# EAGLE design Kicking Device v13b (EAGLE 9.4.2)

## Sheet 1 of 2
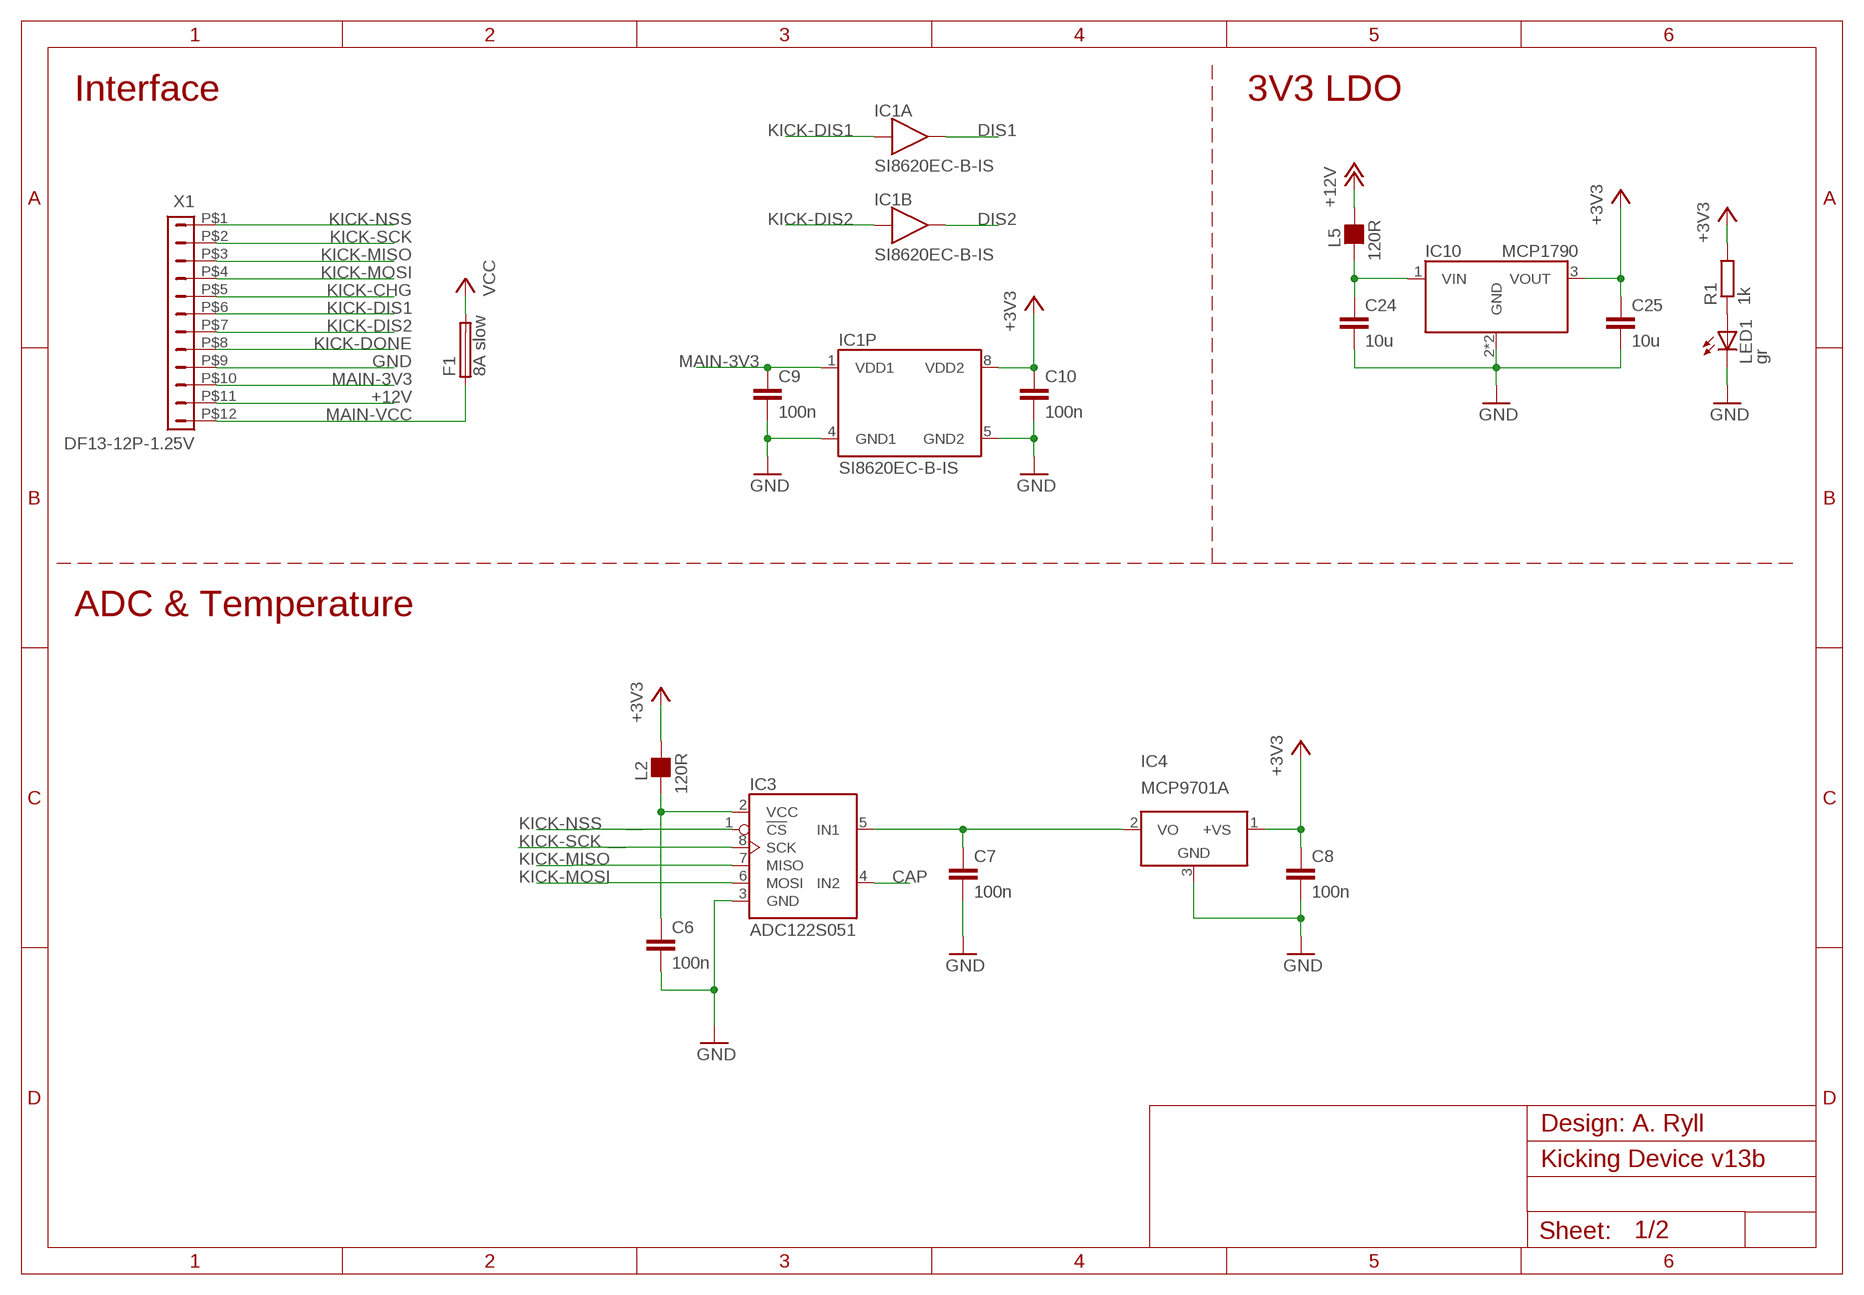
[diagram p0: schematic, sheet 1]

### Parts
C6  100n  C-EUC0603  [C0603]
C7  100n  C-EUC0603  [C0603]
C8  100n  C-EUC0603  [C0603]
C9  100n  C-EUC0603  [C0603]
C10  100n  C-EUC0603  [C0603]
C24  10u  C-EUC0603  [C0603]
C25  10u  C-EUC0603  [C0603]
F1  8A slow  FUSES  [1206]
IC1  SI8620EC-B-IS  SI8620  [SOIC8N]
IC3  ADC122S051  ADC__2S__1  [MSOP8]
IC4  MCP9701A  LM60S  [SOT23]
IC10  MCP1790  [SOT223]
L2  120R  FB_0603  [L0603]
L5  120R  FB_0603  [L0603]
LED1  gr  LEDCHIP-LED0603  [CHIP-LED0603]
R1  1k  R-EU_R0603  [R0603]
X1  DF13-12P-1.25V  [DF13C-12P-1.25V]

### Nets
+3V3: C8.1 C10.1 C25.1 IC1.8(P:VDD2) IC4.1(+VS) IC10.3(VOUT) L2.2 R1.2 ; also sheet 2
+12V: L5.2 X1.P$11 ; also sheet 2
CAP: IC3.4(IN2) ; also sheet 2
DIS1: IC1.7(A:OUT) ; also sheet 2
DIS2: IC1.6(B:OUT) ; also sheet 2
GND: C6.2 C7.2 C8.2 C9.2 C10.2 C24.2 C25.2 IC1.4(P:GND1) IC1.5(P:GND2) IC3.3(GND) IC4.3(GND) IC10.2(GND) IC10.4(GND) LED1.C X1.P$9 ; also sheet 2
KICK-CHG: X1.P$5 ; also sheet 2
KICK-DIS1: IC1.2(A:IN) X1.P$6
KICK-DIS2: IC1.3(B:IN) X1.P$7
KICK-DONE: X1.P$8 ; also sheet 2
KICK-MISO: IC3.7(MISO) X1.P$3
KICK-MOSI: IC3.6(MOSI) X1.P$4
KICK-NSS: IC3.1(!CS) X1.P$1
KICK-SCK: IC3.8(SCK) X1.P$2
MAIN-3V3: C9.1 IC1.1(P:VDD1) X1.P$10
MAIN-VCC: F1.1 X1.P$12
N$3: C24.1 IC10.1(VIN) L5.1
N$185: C6.1 IC3.2(VCC) L2.1
N$190: C7.1 IC3.5(IN1) IC4.2(VO)
N$191: LED1.A R1.1
VCC: F1.2 ; also sheet 2

### Notes on the sheet
- Interface | 3V3 LDO
- ADC & Temperature
- Design: A. Ryll

## Sheet 2 of 2
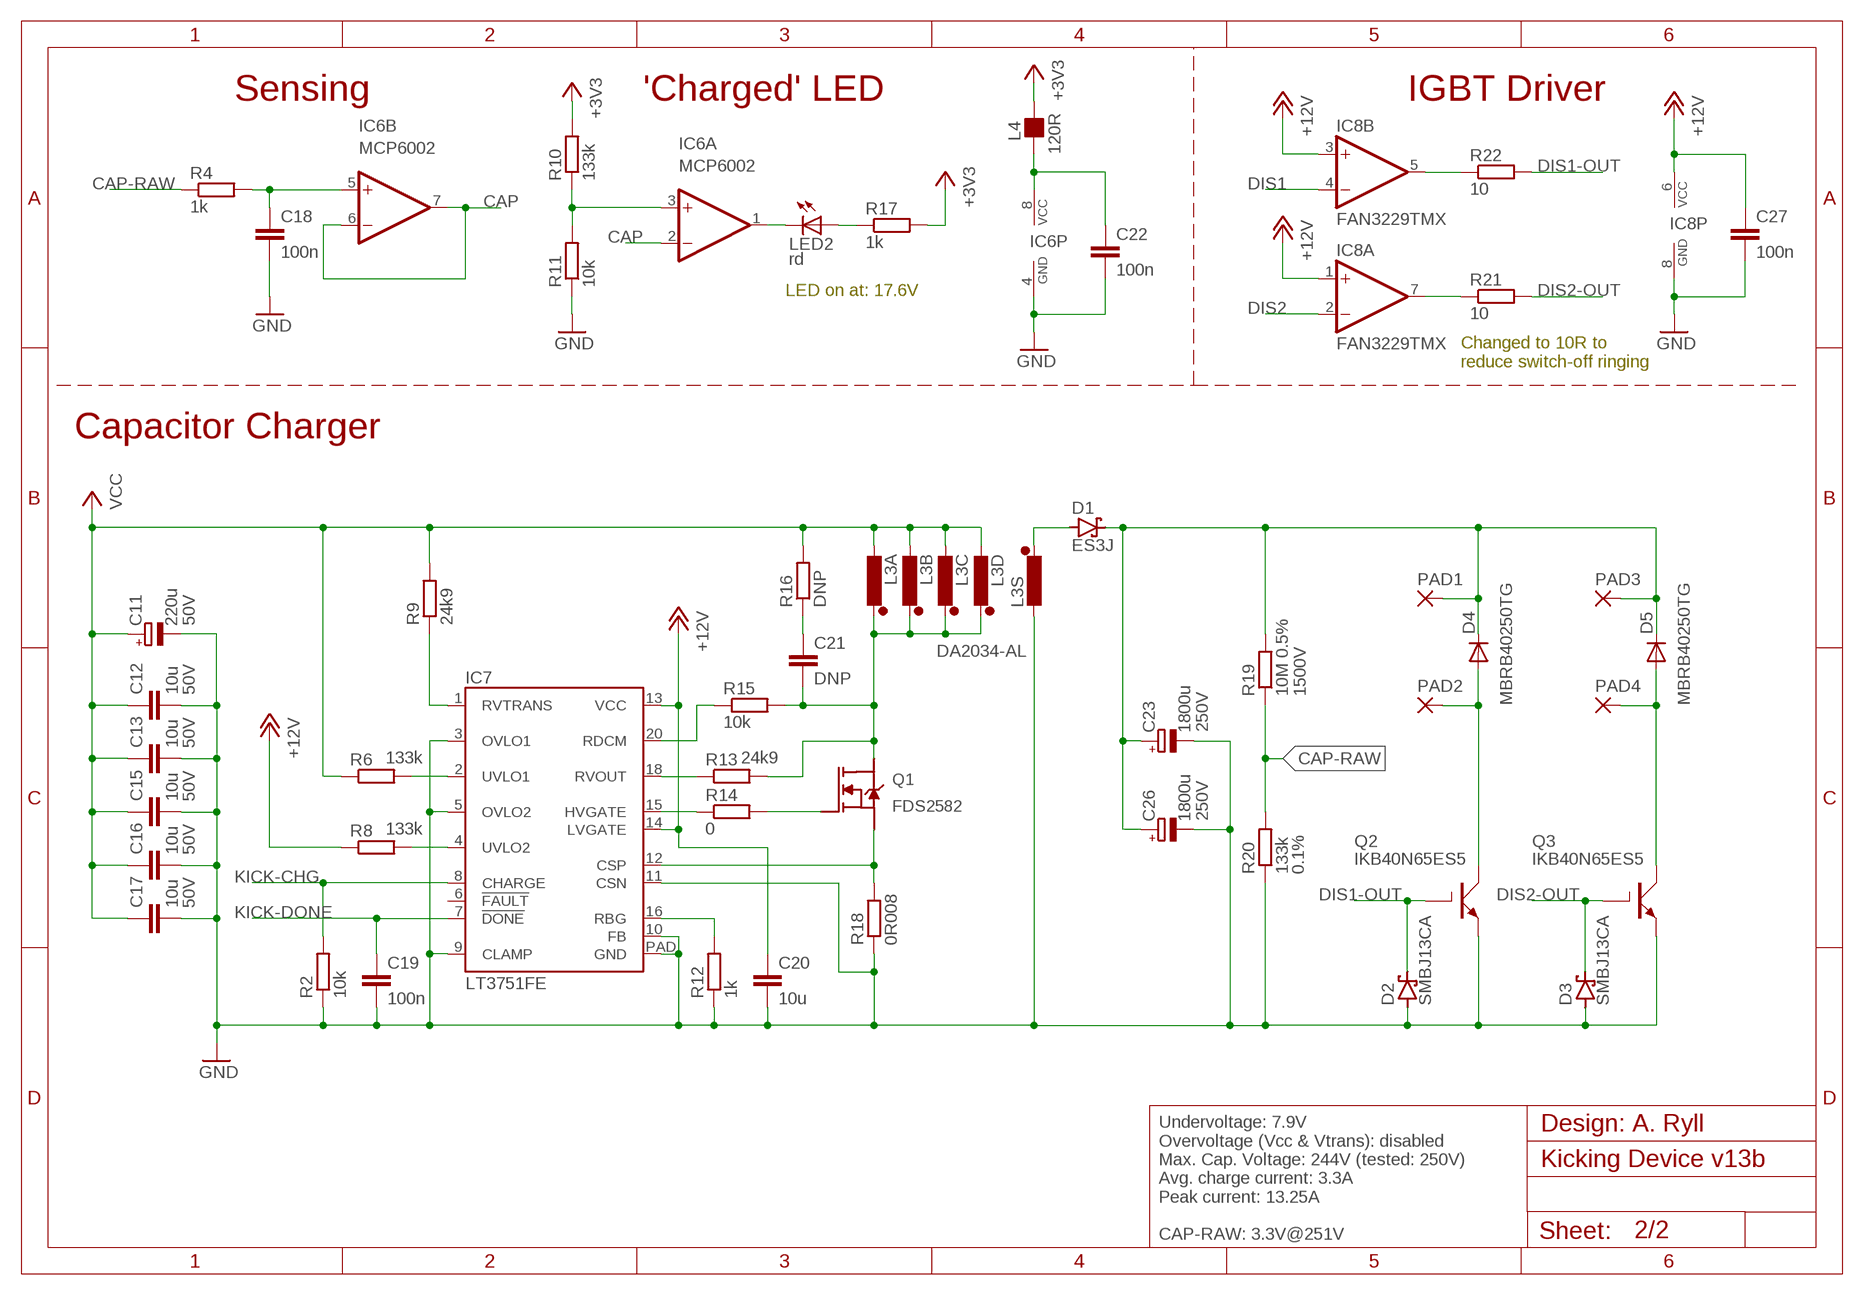
[diagram p1: schematic, sheet 2]

### Parts
C11  220u  CPOL-EUF  [PANASONIC_F]
C12  10u  C-EUC1210  [C1210]
C13  10u  C-EUC1210  [C1210]
C15  10u  C-EUC1210  [C1210]
C16  10u  C-EUC1210  [C1210]
C17  10u  C-EUC1210  [C1210]
C18  100n  C-EUC0603  [C0603]
C19  100n  C-EUC0603  [C0603]
C20  10u  C-EUC0603  [C0603]
C21  DNP  C-EUC0805  [C0805]
C22  100n  C-EUC0603  [C0603]
C23  1800u  CPOL-EUE10-35  [EB35D]
C26  1800u  CPOL-EUE10-35  [EB35D]
C27  100n  C-EUC0603  [C0603]
D1  ES3J  SCHOTTKY-DIODESMC  [SMC]
D2  SMBJ13CA  SCHOTTKY-DIODESMD  [SMB]
D3  SMBJ13CA  SCHOTTKY-DIODESMD  [SMB]
D4  MBRB40250TG  DIODED2  [D2PAK]
D5  MBRB40250TG  DIODED2  [D2PAK]
IC6  MCP6002  AD-OP2SN  [SOIC8N]
IC7  LT3751FE  [TSSOP20P]
IC8  FAN3229TMX  FAN3229_MXN  [SOIC8N]
L3  DA2034-AL  DA203X-AL4  [DA2034-AL]
L4  120R  FB_0603  [L0603]
LED2  rd  LEDCHIP-LED0603  [CHIP-LED0603]
PAD1  WIREPAD2,54/1,0  [2,54/1,0]
PAD2  WIREPAD2,54/1,0  [2,54/1,0]
PAD3  WIREPAD2,54/1,0  [2,54/1,0]
PAD4  WIREPAD2,54/1,0  [2,54/1,0]
Q1  FDS2582  NMOSSOIC8N  [SOIC8N]
Q2  IKB40N65ES5  IGBTTO263AB  [D2PAK]
Q3  IKB40N65ES5  IGBTTO263AB  [D2PAK]
R2  10k  R-EU_R0603  [R0603]
R4  1k  R-EU_R0603  [R0603]
R6  133k  R-EU_R0603  [R0603]
R8  133k  R-EU_R0603  [R0603]
R9  24k9  R-EU_R0603  [R0603]
R10  133k  R-EU_R0603  [R0603]
R11  10k  R-EU_R0603  [R0603]
R12  1k  R-EU_R0603  [R0603]
R13  24k9  R-EU_R0603  [R0603]
R14  0  R-EU_R1206  [R1206]
R15  10k  R-EU_R0603  [R0603]
R16  DNP  R-EU_R0805  [R0805]
R17  1k  R-EU_R0603  [R0603]
R18  0R008  R-EU_R1206  [R1206]
R19  10M 0.5%  R-EU_R1206  [R1206]
R20  133k  R-EU_R0603  [R0603]
R21  10  R-EU_R1206  [R1206]
R22  10  R-EU_R1206  [R1206]

### Nets
+3V3: L4.2 R10.2 R17.2 ; also sheet 1
+12V: C20.1 C27.1 IC7.13(VCC) IC7.14(LVGATE) IC8.1(A:+IN) IC8.3(B:+IN) IC8.6(P:VCC) R8.1 ; also sheet 1
CAP: IC6.2(A:-IN) IC6.6(B:-IN) IC6.7(B:OUT) ; also sheet 1
CAP-RAW: R4.1 R19.1 R20.2
CSP: IC7.12(CSP) Q1.1(S) Q1.2(S) Q1.3(S) R18.2
DIS1: IC8.4(B:-IN) ; also sheet 1
DIS1-OUT: D2.C Q2.1(G) R22.2
DIS1C [HV]: D4.1(A) D4.3(A) PAD2.1(P) Q2.2(C)
DIS2: IC8.2(A:-IN) ; also sheet 1
DIS2-OUT: D3.C Q3.1(G) R21.2
DIS2C [HV]: D5.1(A) D5.3(A) PAD4.1(P) Q3.2(C)
GND: C11.- C12.2 C13.2 C15.2 C16.2 C17.2 C18.2 C19.2 C20.2 C22.2 C23.- C26.- C27.2 D2.A D3.A IC6.4(P:GND) IC7.3(OVLO1) IC7.5(OVLO2) IC7.9(CLAMP) IC7.10(FB) IC7.11(CSN) IC7.PAD(GND) IC8.8(P:GND) L3.12 Q2.3(E) Q3.3(E) R2.1 R11.1 R12.1 R18.1 R20.1 ; also sheet 1
KICK-CHG: IC7.8(CHARGE) R2.2 ; also sheet 1
KICK-DONE: C19.1 IC7.7(!DONE) ; also sheet 1
LOUT: D1.A L3.1
N$1: IC8.7(A:OUT) R21.1
N$2: IC8.5(B:OUT) R22.1
N$196: C22.1 IC6.8(P:VCC) L4.1
N$198: IC6.3(A:+IN) R10.1 R11.2
N$199: C18.1 IC6.5(B:+IN) R4.2
N$200: LED2.A R17.1
N$201: IC6.1(A:OUT) LED2.C
N$208: IC7.16(RBG) R12.2
N$209: C21.1 R16.1
N$210: Q1.4(G) R14.2
N$211: IC7.15(HVGATE) R14.1
N$212: IC7.18(RVOUT) R13.1
N$213: IC7.20(RDCM) R15.1
N$214: IC7.1(RVTRANS) R9.1
N$216: IC7.2(UVLO1) R6.2
N$218: IC7.4(UVLO2) R8.2
VCAP [HV]: C23.+ C26.+ D1.C D4.2(C) D5.2(C) PAD1.1(P) PAD3.1(P) R19.2
VCC: C11.+ C12.1 C13.1 C15.1 C16.1 C17.1 L3.3 L3.4 L3.5 L3.6 R6.1 R9.2 R16.2 ; also sheet 1
VDRAIN: C21.2 L3.7 L3.8 L3.9 L3.10 Q1.5(D) Q1.6(D) Q1.7(D) Q1.8(D) R13.2 R15.2
Unconnected: IC7.6(!FAULT)

### Notes on the sheet
- Sensing | 'Charged' LED | IGBT Driver
- LED on at: 17.6V
- Changed to 10R to
  reduce switch-off ringing
- Capacitor Charger
- Design: A. Ryll
- Undervoltage: 7.9V
  Overvoltage (Vcc & Vtrans): disabled
  Max. Cap. Voltage: 244V (tested: 250V)
  Avg. charge current: 3.3A
  Peak current: 13.25A
- CAP-RAW: 3.3V@251V

## Library data of the parts
C6-C10 C18-C22 C24 C25 C27 = rcl:C-EU: CAPACITOR, European symbol; SPICEPREFIX: C
C11 = rcl:CPOL-EU: POLARIZED CAPACITOR, European symbol; PARTNR: EEEFT1H221AP; SPICEPREFIX: C; VMAX: 50V
C12 C13 C15-C17 = rcl:C-EU: CAPACITOR, European symbol; PARTNR: C3225X5R1H106M250AB; SPICEPREFIX: C; VMAX: 50V
C23 C26 = rcl:CPOL-EU: POLARIZED CAPACITOR, European symbol; SPICEPREFIX: C; VMAX: 250V
D1-D3 = diode:SCHOTTKY-DIODE: Schottky Diode
D4 D5 = TIGERs:DIODE
F1 = TIGERs:FUSE: 1 SCHURTER 0031.3558 Farnell: 1453524 2 SCHURTER 0031.8201 Farnell: 1162740
IC1 = TIGERs:SI8620
IC3 = TIGERs:ADC__2S__1
IC4 = TIGERs:LM60: LM60 Temperature Sensor -40°C to 125°C
IC6 = TIGERs:AD-OP2
IC7 = TIGERs:LT3751
IC8 = TIGERs:FAN322
IC10 = TIGERs:MCP1790
L2 L4 L5 = rc-master-smd:FB_: FERRITE BEAD
L3 = TIGERs:DA203X-AL
LED1 LED2 = led:LED: LED OSRAM: - CHIPLED LG R971, LG N971, LY N971, LG Q971, LY Q971, LO R971, LY R971 LH N974, LH R974 LS Q976, LO Q976, LY Q976 LO Q996 - Hyper CHIPLED LW Q18S LB Q993, LB Q99A, LB R99A - SideLED LS A670, LO A670, LY A670, LG A670, LP A670 LB A673, LV A673, LT A673, LW A673 LH A674 LY A675 LS A676, LA A676, LO A676, LY A676, LW A676 LS A679, LY A679, LG A679 - Hyper Micro SIDELED® LS Y876, LA Y876, LO Y876, LY Y876 LT Y87S - SmartLED LW L88C, LW L88S LB L89C, LB L89S, LG L890 LS L89K, LO L89K, LY L89K LS L896, LA L896, LO L896, LY L896 - TOPLED LS T670, LO T670, LY T670, LG T670, LP T670 LSG T670, LSP T670, LSY T670, LOP T670, LYG T670 LG T671, LOG T671, LSG T671 LB T673, LV T673, LT T673, LW T673 LH T674 LS T676, LA T676, LO T676, LY T676, LB T676, LH T676, LSB T676, LW T676 LB T67C, LV T67C, LT T67C, LS T67K, LO T67K, LY T67K, LW E67C LS E67B, LA E67B, LO E67B, LY E67B, LB E67C, LV E67C, LT E67C LW T67C LS T679, LY T679, LG T679 LS T770, LO T770, LY T770, LG T770, LP T770 LB T773, LV T773, LT T773, LW T773 LH T774 LS E675, LA E675, LY E675, LS T675 LS T776, LA T776, LO T776, LY T776, LB T776 LHGB T686 LT T68C, LB T68C - Hyper Mini TOPLED® LB M676 - Mini TOPLED Santana® LG M470 LS M47K, LO M47K, LY M47K Source: http://www.osram.convergy.de LUXEON: - LUMILED® LXK2-PW12-R00, LXK2-PW12-S00, LXK2-PW14-U00, LXK2-PW14-V00 LXK2-PM12-R00, LXK2-PM12-S00, LXK2-PM14-U00 LXK2-PE12-Q00, LXK2-PE12-R00, LXK2-PE12-S00, LXK2-PE14-T00, LXK2-PE14-U00 LXK2-PB12-K00, LXK2-PB12-L00, LXK2-PB12-M00, LXK2-PB14-N00, LXK2-PB14-P00, LXK2-PB14-Q00 LXK2-PR12-L00, LXK2-PR12-M00, LXK2-PR14-Q00, LXK2-PR14-R00 LXK2-PD12-Q00, LXK2-PD12-R00, LXK2-PD12-S00 LXK2-PH12-R00, LXK2-PH12-S00 LXK2-PL12-P00, LXK2-PL12-Q00, LXK2-PL12-R00 Source: www.luxeon.com KINGBRIGHT: KA-3528ASYC Source: www.kingbright.com
PAD1-PAD4 = TIGERs:WIREPAD: Wire PAD connect wire on PCB
Q1 = TIGERs:NMOS
Q2 Q3 = TIGERs:IGBT
R1 R2 R4 R9 R11-R18 R21 R22 = rcl:R-EU_: RESISTOR, European symbol; SPICEPREFIX: R
R6 R8 R10 R20 = rcl:R-EU_: RESISTOR, European symbol; SPICEPREFIX: R; TOL: 0.1%
R19 = rcl:R-EU_: RESISTOR, European symbol; SPICEPREFIX: R; VMAX: 1500V
X1 = con-hirose-df13:DF13-12P-1.25: DF13-12P 1.25mm Pitch Miniature Crimping Connector.

## Net classes
1 HV: width 0.203 mm, drill 0.305 mm, clearance 0.762 mm

## Board
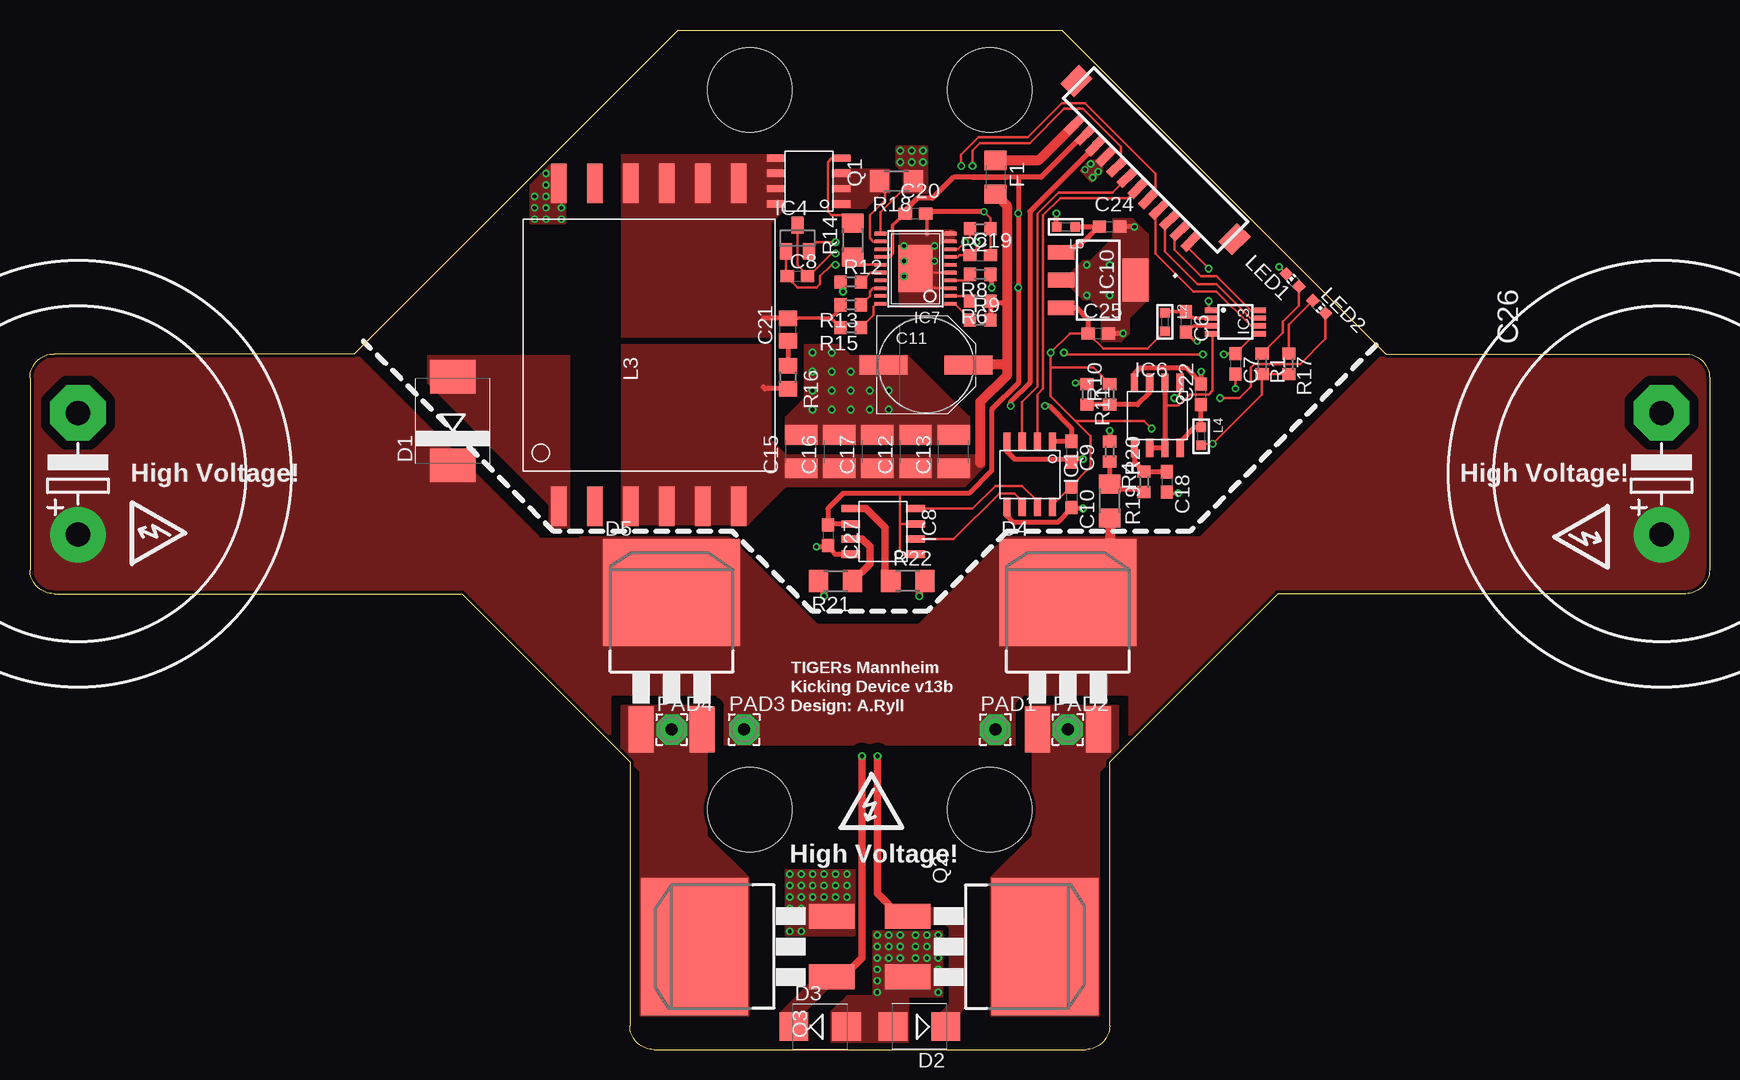
[diagram p2: board, top side]
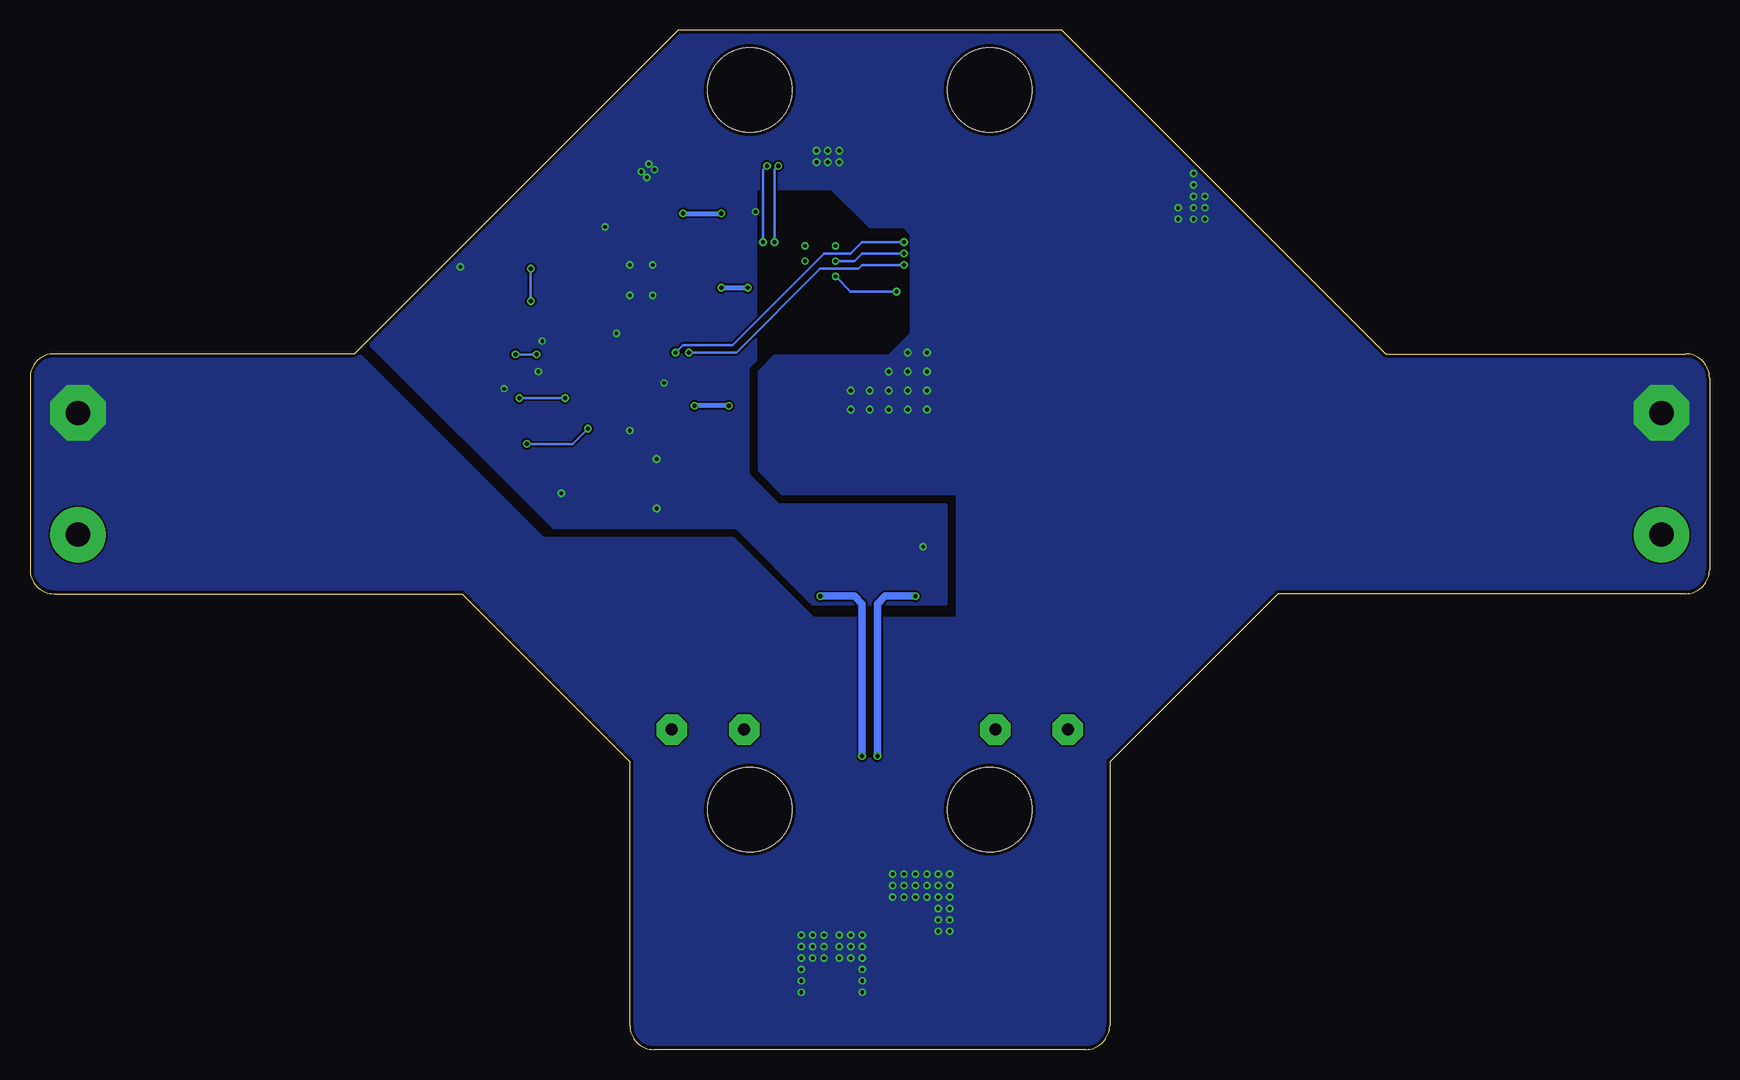
[diagram p3: board, bottom side, seen from below]

Size 140 x 85 mm. Coordinates in mm from the lower left corner, seen from the top.
Outline: 54,85 86,85 113,58 138,58 arc-90 140,56 140,40 arc-90 138,38 104,38 90,24 90,2 arc-90 88,0 52,0 arc-90 50,2 50,24 36,38 2,38 arc-90 0,40 0,56 arc-90 2,58 27,58 54,85
Copper layers (1*16): Top 0.035mm / dielectric 1.5mm / Bottom 0.035mm
Design rules "PCB-POOL Standard *": minimum track width 0.15mm, minimum drill 0.3mm, track to track 0.15mm, track to pad 0.15mm, pad to pad 0.15mm, via to via 0.15mm, smd to smd 0.15mm, copper to edge 0.3mm, drill to drill 0.2mm, minimum pad ring 0.2mm, minimum via ring 0.15mm, stop-mask expansion 0.075mm, vias tented up to drill 14mil, thermal gap 0.2mm
Holes 7 mm at 60,80 80,80 60,20 80,20
tKeepout: area 55.5,75.5 to 64.5,84.5; area 75.5,75.5 to 84.5,84.5; area 55.5,15.5 to 64.5,24.5; area 75.5,15.5 to 84.5,24.5
bKeepout: area 57,17 to 83,23; area 57,77 to 83,83

### Footprints (pad centres in the part's own frame; a part is rotated, then mirrored left to right if it is on the bottom)
C0603 = smd 1.1 x 1: 1 -0.85,0; 2 0.85,0
PANASONIC_F = smd 4 x 1.6: + 3.55,0; - -3.55,0
C1210 = smd 1.6 x 2.7: 1 -1.4,0; 2 1.4,0
C0805 = smd 1.3 x 1.5: 1 -0.95,0; 2 0.95,0
EB35D = drill 2.007 pad 4.597: + -5.08,0 | drill 2.007 pad 4.597 octagon: - 5.08,0
SMC = smd 2.8 x 3.8: A 3.7,0; C -3.7,0
SMB = smd 2.4 x 2.4: A 2.2,0; C -2.2,0
D2PAK = smd 2.083 x 3.81: 1 -2.54,-8.89; 3 2.54,-8.89 | smd 11.43 x 8.89: 2 0,2.54
1206 = smd 1.6 x 1.8: 1 -1.4,0; 2 1.4,0
SOIC8N = smd 1.55 x 0.6: 1 -2.7,1.905; 2 -2.7,0.635; 3 -2.7,-0.635; 4 -2.7,-1.905; 5 2.7,-1.905; 6 2.7,-0.635; 7 2.7,0.635; 8 2.7,1.905
MSOP8 = smd 0.45 x 1: 1 -0.975,-2.05; 2 -0.325,-2.05; 3 0.325,-2.05; 4 0.975,-2.05; 5 0.975,2.05; 6 0.325,2.05; 7 -0.325,2.05; 8 -0.975,2.05
SOT23 = smd 1 x 1.4: 1 -0.95,-1.1; 2 0.95,-1.1; 3 0,1.1
TSSOP20P = smd 0.305 x 0.991: 1 -2.925,-2.918; 2 -2.275,-2.918; 3 -1.625,-2.918; 4 -0.975,-2.918; 5 -0.325,-2.918; 6 0.325,-2.918; 7 0.975,-2.918; 8 1.625,-2.918; 9 2.275,-2.918; 10 2.925,-2.918; 11 2.925,2.918; 12 2.275,2.918; 13 1.625,2.918; 14 0.975,2.918; 15 0.325,2.918; 16 -0.325,2.918; 17 -0.975,2.918; 18 -1.625,2.918; 19 -2.275,2.918; 20 -2.925,2.918 | smd 3.9 x 2.8: PAD 0,0
SOT223 = smd 1.219 x 2.235: 1 -2.311,-3.099; 2 0,-3.099; 3 2.311,-3.099 | smd 3.6 x 2.2: 4 0,3.099
L0603 = smd 0.8 x 0.8: 1 -0.762,0; 2 0.762,0
DA2034-AL = smd 3.3 x 1.27: 1 -13.46,7.5; 2 -13.46,4.5; 3 -13.46,1.5; 4 -13.46,-1.5; 5 -13.46,-4.5; 6 -13.46,-7.5; 7 13.46,-7.5; 8 13.46,-4.5; 9 13.46,-1.5; 10 13.46,1.5; 11 13.46,4.5; 12 13.46,7.5
CHIP-LED0603 = smd 0.8 x 0.8: A 0,-0.75; C 0,0.75
2,54/1,0 = drill 1.016 pad 2.54 octagon: 1 0,0
R0603 = smd 1 x 1.1: 1 -0.85,0; 2 0.85,0
R1206 = smd 1.6 x 1.803: 1 -1.422,0; 2 1.422,0
R0805 = smd 1.3 x 1.5: 1 -0.95,0; 2 0.95,0
DF13C-12P-1.25V = smd 1.6 x 2.2: M$0 9.325,-1.8; M$1 -9.325,-1.8 | smd 0.7 x 1.8: P$1 -6.875,0.9; P$2 -5.625,0.9; P$3 -4.375,0.9; P$4 -3.125,0.9; P$5 -1.875,0.9; P$6 -0.625,0.9; P$7 0.625,0.9; P$8 1.875,0.9; P$9 3.125,0.9; P$10 4.375,0.9; P$11 5.625,0.9; P$12 6.875,0.9

### Placement (x,y rotation side)
C6  96.35,60.65 270 top
C7  100.48,57.16 270 top
C8  63.97,64.46 0 top
C9  86.83,49.86 270 top
C10  86.83,46.05 270 top
C11  74.7,57.07 0 top
C12  73.81,49.86 90 top
C13  76.98,49.86 90 top
C15  64.28,49.86 90 top
C16  67.46,49.86 90 top
C17  70.64,49.86 90 top
C18  94.77,47.32 270 top
C19  79.21,66.21 0 top
C20  73.81,69.7 0 top
C21  63.17,60.02 90 top
C22  97.62,54.62 90 top
C23  4,48 90 top
C24  90,68.59 0 top
C25  89.05,59.7 0 top
C26  136,48 90 top
C27  66.51,42.87 270 top
D1  35.23,52.4 90 top
D2  74.13,1.91 180 top
D3  65.87,1.91 0 top
D4  86.51,35.57 0 top
D5  53.49,35.57 0 top
F1  80.48,72.72 270 top
IC1  83.34,47.95 270 top
IC3  100.48,60.65 270 top
IC4  63.97,67.64 0 top
IC6  93.97,52.87 270 top
IC7  73.81,65.1 90 top
IC8  71.11,43.19 180 top
IC10  89.05,64.14 270 top
L2  94.61,60.65 270 top
L3  51.59,58.75 90 top
L4  97.62,51.13 270 top
L5  86.35,68.59 180 top
LED1  105.24,64.14 45 top
LED2  107.47,61.92 225 top
PAD1  80.48,26.68 0 top
PAD2  86.51,26.68 0 top
PAD3  59.52,26.68 0 top
PAD4  53.49,26.68 0 top
Q1  64.92,72.4 180 top
Q2  82.06,8.58 270 top
Q3  57.94,8.58 90 top
R1  102.7,57.16 270 top
R2  79.21,68.43 180 top
R4  92.86,47.32 90 top
R6  79.21,62.4 180 top
R8  79.21,64.62 180 top
R9  79.21,60.81 0 top
R10  90,54.62 90 top
R11  88.1,54.62 270 top
R12  68.41,63.99 0 top
R13  68.41,62.08 180 top
R14  68.57,67.48 90 top
R15  68.41,60.18 180 top
R16  63.17,56.05 270 top
R17  104.92,57.16 270 top
R18  72.22,72.4 180 top
R19  90,45.73 270 top
R20  90,49.86 270 top
R21  67.14,39.06 180 top
R22  73.17,39.06 0 top
X1  92.54,72.88 135 top

### Tracks (layer width: path | path; a pad name or v marks a point on that pad's centre or on a via)
+3V3  (via drill 0.35)
  Top 0.152: 63.02,64.56 C8.1
  Top 0.203: IC4.1 63.02,64.56 C8.1 63.12,64.36 63.97,63.51 65.56,63.51 65.87,63.83 65.87,64.46 66.83,65.41 v67.14,65.41 | IC1.8 85.24,45.41 86.72,46.9 C10.1 86.83,47 88.41,48.59 88.41,51.13 87.14,52.4 | L4.2 97.75,50.49 v98.58,50.49 102.7,54.62 R1.2 R17.2 | v93.5,51.76 92.86,52.4 87.14,52.4 | 85.08,56.84 85.08,54.46 87.14,52.4 | 85.08,56.84 v85.08,58.11 86.67,59.7 C25.1 89.47,58.43 93.15,58.43 L2.2 | R10.2 88.63,56.84 85.08,56.84
  Top 0.406: L2.2 94.48,60.02 | IC10.3 87.23,61.83 88.2,60.87 C25.1
  Bottom 0.203: v67.14,65.41 70.64,65.41 70.95,65.1 74.13,65.1 81.11,58.11 v85.08,58.11 | v98.58,50.49 94.77,50.49 v93.5,51.76
+12V  (via drill 0.35)
  Top 0.203: IC8.3 72.54,43.83 | 72.54,43.83 72.54,46.37 | IC8.1 72.86,41.28 72.54,41.6 72.54,43.83
  Top 0.305: IC7.14 71.61,66.07 71.91,66.37 71.91,66.69 | IC7.13 71.87,66.72 71.91,66.69 | C20.1 71.91,68.75 71.91,66.69 | 87.79,76.22 X1.P$11
  Top 0.406: 82.38,72.72 84.29,72.72 86.83,75.26 87.79,76.22 | 82.38,72.72 79.84,72.72 78.57,72.72 81.43,72.72 76.98,72.72 75.24,70.97 73.97,70.97 72.86,69.86 C20.1 | 82.38,72.72 v82.38,69.7 v82.38,63.51 82.38,55.57 80.16,53.35 80.16,48.27 78.25,46.37 72.54,46.37 67.78,46.37 66.51,45.09 C27.1 66.61,43.83 IC8.6 68.03,43.82 | R8.1 80.16,64.52 v80.16,63.51 | L5.2 85.56,68.62 v85.56,69.7
  Bottom 0.406: v82.38,63.51 v80.16,63.51 | v85.56,69.7 v82.38,69.7
CAP
  Top 0.203: IC3.4 98.58,59.53 98.58,54.94 98.26,54.62 96.67,54.62 95.72,53.67 94.61,53.67
  Top 0.406: 98.41,59.7 IC3.4 | IC6.6 IC6.7 94.61,53.67 94.61,54.3 IC6.2
CAP-RAW
  Top 0.406: R20.2 R19.1 90.47,46.68 92.64,46.68 R4.1
CSP
  Top 0.203: IC7.12 70.27,67.37 70,67.64 70,69.54 71.27,70.81 71.27,71.93 R18.2
  pour Top (no thermals): 67.14,70.18 69.68,70.18 70.95,71.45 71.59,71.45 71.59,73.35 67.14,73.35
DIS1
  Top 0.203: IC8.4 78.57,45.09 80.48,47 82.7,47 83.97,45.73 IC1.7
DIS1-OUT  (via drill 0.35)
  Top 0.61: R22.2 74.13,38.59 v74.13,37.79 | Q2.1 72.54,11.12 70.64,13.03 v70.64,24.46
  Bottom 0.61: v74.13,37.79 71.27,37.79 70.64,37.16 v70.64,24.46
  pour Top (no thermals): 75.72,1.28 75.72,2.87 76.67,3.82 76.67,10.17 76.35,10.49 72.22,10.49 72.22,11.76 76.98,11.76 77.94,10.8 77.94,3.5
DIS1C
  pour Top (no thermals): 83.65,28.59 83.65,17.79 80.16,14.3 80.16,2.87 89.05,2.87 89.05,23.19 90.64,24.77 90.64,28.59
DIS2
  Top 0.203: IC8.2 76.98,42.55 80.8,46.37 82.06,46.37 82.7,45.73 IC1.6
DIS2-OUT  (via drill 0.35)
  Top 0.61: R21.2 66.19,38.59 v66.19,37.79 | Q3.1 67.78,6.04 | Q3.1 67.14,6.36 | 67.78,6.04 Q3.1 | v69.36,24.46 69.36,7.63 67.78,6.04
  Bottom 0.61: v66.19,37.79 68.73,37.79 69.36,37.16 v69.36,24.46
  pour Top (no thermals): 62.7,3.19 66.19,6.68 68.09,6.68 68.09,5.41 66.83,5.41 64.6,3.19 64.6,1.28 62.7,1.28
DIS2C
  pour Top (no thermals): 49.36,28.59 56.35,28.59 56.35,17.79 59.84,14.3 59.84,2.87 50.95,2.87 50.95,23.19 49.36,24.77
GND  (via drill 0.3, 0.35)
  Top 0.203: 76.73,68.21 IC7.10 | IC7.11 70.89,69.8 73.49,72.4 R18.1 | C8.2 64.87,64.51 | 64.87,64.51 65.14,64.78 65.24,64.78 66.83,66.37 v67.14,66.37 | 64.87,64.51 63.97,65.41 IC4.3 | LED1.C v104.13,65.26 | v104.13,65.26 | R12.1 67.56,63.41 v67.78,63.19 | 75.24,69.7 C20.2 74.76,69.7 | IC7.5 75.41,64.77 75.4,64.78 | IC7.3 75.44,63.47 75.4,63.51 | v79.53,69.86 80.06,69.33 R2.1 C19.2 | v100.48,55.1 C7.2
  Top 0.305: IC3.3 96.98,60.33 C6.2 97.09,59.06 v97.31,59.06 | C18.2 94.87,46.37 v95.72,46.37 | 74.76,69.7 74.76,67.95
  Top 0.406: v90,51.6 R20.1 | IC8.8 67.14,41.28 C27.2 arc-45 66.26,41.92 v65.56,41.92 | C20.2 74.92,69.86 v79.53,69.86 | v91.11,59.7 C25.2 | v92.07,68.59 C24.2 | IC1.5 81.43,44.46 81.91,43.98 85.72,43.98 86.83,45.09 | 86.83,45.09 C10.2 | v87.78,45.09 86.83,45.09 | IC1.4 81.43,49.86 82.06,49.22 86.61,49.22 | 86.61,49.22 C9.2 | v87.78,49.22 86.61,49.22 | IC6.4 92.07,56.37 92.54,56.84 96.35,56.84 97.62,55.57 | 97.62,55.57 C22.2 | v97.62,56.52 97.62,55.57 | R11.1 88,55.57 v87.14,55.57
  Top 0.813: R18.1 73.49,72.55 | 71.05,57.16 C11.-
  Bottom 0.203: v72.86,65.73 71.27,65.73 70.64,66.37 v67.14,66.37 | v72.86,64.46 71.59,63.19 v67.78,63.19
  other vias: 88.41,73.83 89.05,73.19 87.94,73.35 88.57,72.72 75.4,65.73 75.4,67 72.86,67 43.01,73.03 73.49,73.99 65.24,58.11 74.44,73.99 72.54,73.99 72.54,74.94 73.49,74.94 74.44,74.94 66.83,58.11 65.24,56.52 66.83,56.52 68.41,56.52 66.83,54.94 65.24,54.94 68.41,54.94 70,54.94 65.24,53.35 66.83,53.35 68.41,53.35 70,53.35 71.59,54.94 71.59,53.35 68.09,12.71 67.14,12.71 66.19,12.71 65.24,12.71 64.28,12.71 64.28,11.76 64.28,10.8 64.28,9.85 64.28,13.66 65.24,13.66 66.19,13.66 67.14,13.66 68.09,13.66 63.33,9.85 63.33,10.8 63.33,11.76 63.33,12.71 63.33,13.66 74.76,7.63 73.81,7.63 72.54,7.63 71.59,7.63 70.64,7.63 70.64,6.68 70.64,5.73 70.64,4.77 70.64,8.58 71.59,8.58 72.54,8.58 73.81,8.58 74.76,8.58 75.72,4.77 75.72,5.73 75.72,6.68 75.72,7.63 75.72,8.58 70.64,9.53 71.59,9.53 72.54,9.53 73.81,9.53 74.76,9.53 75.72,9.53 64.28,14.62 65.24,14.62 66.19,14.62 67.14,14.62 68.09,14.62 63.33,14.62 90,65.41 88.1,65.41 90,62.88 88.1,62.88 43.01,72.08 43.01,71.13 43.01,70.18 44.28,70.18 44.28,69.22 43.01,69.22 42.06,71.13 42.06,70.18 42.06,69.22
  pour Top (no thermals): 75.72,61.92 75.72,67 76.03,67.32 76.98,67.32 76.98,68.27 72.54,68.27 72.54,61.92
  pour Top (no thermals): 90,75.26 90.48,74.78 89.37,73.67 89.37,73.19 88.49,72.32 87.54,73.27 88.41,74.15 88.89,74.15
  pour Bottom (rank 2, no thermals): -1.44,58.75 -1.44,-0.47 140.96,-0.47 140.96,59.06 113.81,59.06 97.31,42.55 81.43,42.55 74.76,35.89 49.68,35.89 26.82,58.75
  pour Bottom (rank 2): 79.53,85.42 52.54,85.42 25.55,58.43 48.09,35.89 62.7,35.89 62.7,46.37 77.3,46.37 79.21,48.27 79.21,56.52 77.94,57.8 68.41,57.8 66.51,59.7 66.51,67.95 67.14,68.59 70,68.59 73.17,71.77 79.53,71.77
  pour Bottom: 79.53,85.42 86.19,85.42 111.59,60.02 111.59,58.75 96.35,43.51 81.11,43.51 74.76,37.16 63.65,37.16 63.65,45.41 77.62,45.41 80.16,47.95 80.16,56.84 79.53,57.48
  pour Top (no thermals): 63.02,50.49 63.02,52.72 64.6,54.3 64.6,58.75 67.46,58.75 68.41,57.8 73.17,57.8 78.25,52.72 78.25,50.49
  pour Top (no thermals): 72.86,71.45 72.86,73.03 72.22,73.67 72.22,75.26 74.76,75.26 74.76,71.45
  pour Top (no thermals): 70.32,4.45 76.03,4.45 76.03,9.85 70.32,9.85
  pour Top (no thermals): 63.02,9.53 68.73,9.53 68.73,14.93 63.02,14.93
  pour Top (no thermals): 70.32,4.45 68.09,4.45 66.83,3.19 66.83,0.65 73.17,0.65 73.17,4.45
  pour Top (no thermals): 85.24,64.46 86.51,64.46 87.78,65.73 88.41,65.73 90.32,67.64 90.32,69.22 91.91,69.22 93.18,67.95 93.18,62.56 91.59,60.97 91.59,59.7 90.95,59.06 89.37,59.06 89.37,61.61 88.41,62.56 87.78,62.56 86.51,63.83 85.24,63.83
  pour Top (no thermals): 44.6,73.67 43.33,73.67 41.74,72.08 41.74,68.91 44.6,68.91
KICK-CHG  (via drill 0.35)
  Top 0.203: 77.02,66.72 IC7.8 77.34,66.72 v77.94,67.32 78.36,67.74 R2.2 | X1.P$5 93.81,71.5 93.81,73.03 87.94,78.91 86.03,78.91 83.18,76.05 79.05,76.05 77.62,74.62 v77.62,73.67
  Bottom 0.203: v77.62,73.67 77.94,73.35 v77.94,67.32
KICK-DIS1
  Top 0.203: X1.P$6 91.52,70.97 85.88,70.97 84.45,69.54 84.45,55.1 83.97,54.62 IC1.2
KICK-DIS2
  Top 0.203: X1.P$7 90.23,71.45 85.72,71.45 83.97,69.7 83.97,55.26 82.7,53.98 IC1.3
KICK-DONE  (via drill 0.35)
  Top 0.152: 90.53,73.57 X1.P$8
  Top 0.203: IC7.7 77.33,66.07 77.46,66.21 C19.1 78.89,66.74 v78.89,67.32 | X1.P$8 90.95,73.94 90.95,75.26 87.78,78.43 86.19,78.43 83.34,75.58 79.21,75.58 78.57,74.94 v78.57,73.67
  Bottom 0.203: v78.57,73.67 78.89,73.35 v78.89,67.32
KICK-MISO
  Top 0.203: IC3.7 101.74,60.98 98.89,63.83 97.31,63.83 94.61,66.53 94.61,68.75 X1.P$3
KICK-MOSI
  Top 0.152: 93.81,69.73 X1.P$4
  Top 0.203: IC3.6 101.75,60.34 98.89,63.19 96.99,63.19 93.81,66.37 93.81,69.73 X1.P$4
KICK-NSS  (via drill 0.35)
  Top 0.203: IC3.1 98.26,61.8 v98.26,62.4 | v98.26,65.1 96.35,67 96.73,67.38 X1.P$1
  Bottom 0.203: v98.26,62.4 v98.26,65.1
KICK-SCK
  Top 0.203: X1.P$2 95.4,67.78 95.4,66.69 97.62,64.46 98.89,64.46 101.75,61.61 102.51,61.61 IC3.8
LOUT
  pour Top (no thermals): 44.92,43.51 44.92,57.8 33.17,57.8 33.17,55.57 43.33,45.41 43.33,43.51
MAIN-3V3  (via drill 0.35)
  Top 0.406: X1.P$10 88.1,74.62 83.34,69.86 83.34,55.57 81.75,53.98 v81.75,53.67 | v84.61,53.67 84.92,53.67 86.83,51.76 C9.1 85.3,50.71 IC1.1
  Bottom 0.406: v81.75,53.67 v84.61,53.67
MAIN-VCC
  Top 0.813: X1.P$12 84.06,74.12 F1.1
N$1
  Top 0.61: IC8.7 69.36,42.55 70,41.92 70,40.5 R21.1
N$2
  Top 0.61: IC8.5 69.68,45.09 71.27,43.51 71.27,39.55 R22.1
N$3
  Top 0.406: L5.1 C24.1 87.47,67 87.14,67 86.6,66.46 IC10.1
N$185
  Top 0.305: IC3.2 96.98,60.98 C6.1 94.69,61.5 L2.1 94.81,61.62
N$190  (via drill 0.35)
  Top 0.203: IC4.2 65.24,66.86 65.24,67 65.56,67.32 v67.14,67.32 | v86.19,58.11 86.35,57.95 v97.78,57.95 | v99.53,57.95 99.58,58.01 C7.1 102.15,59.68 IC3.5
  Bottom 0.203: v67.14,67.32 70.64,67.32 71.59,66.37 73.81,66.37 81.43,58.75 85.56,58.75 v86.19,58.11 | v99.53,57.95 v97.78,57.95
N$191
  Top 0.203: LED1.A 105.77,62.03 104.45,60.7 104.45,59.76 R1.1
N$196
  Top 0.406: 95.98,49.7 IC6.8 95.88,50.65 97.11,51.89 L4.1 C22.1
N$198
  Top 0.406: IC6.3 93.34,54.78 92.33,53.77 R10.1 R11.2
N$199
  Top 0.406: IC6.5 92.07,48.96 R4.2 C18.1
N$200
  Top 0.203: R17.1 104.92,59.7 104.92,60.44 LED2.A
N$201  (via drill 0.35)
  Top 0.203: 95.72,55.26 95.72,55.79 IC6.1 95.88,54.78 v95.4,54.3 | v99.21,54.3 100.8,54.3 101.75,55.26 101.75,56.84 102.07,57.16 105.88,57.16 108,59.28 LED2.C
  Bottom 0.203: v95.4,54.3 v99.21,54.3
N$208
  Top 0.203: R12.2 70.05,64.77 IC7.16
N$209
  Top 0.406: C21.1 R16.1
N$210
  Top 0.203: R14.2 68.42,68.9 67.78,69.54 66.83,69.54 66.51,69.86 66.51,73.99 66.83,74.31 Q1.4
N$211
  Top 0.203: R14.1 69.21,65.42 IC7.15
N$212
  Top 0.203: IC7.18 70.28,63.47 70,63.19 70,62.82 R13.1
N$213
  Top 0.203: IC7.20 70.57,62.17 70.32,61.92 70.32,61.23 R15.1
N$214
  Top 0.203: IC7.1 77.05,62.17 78.36,60.87 R9.1
N$216
  Top 0.152: 78.36,62.61 R6.2
  Top 0.203: 77.93,62.82 R6.2 77.93,62.82 | IC7.2 77.93,62.82
N$218
  Top 0.203: IC7.4 78.23,64.12 78.36,64.25 R8.2
VCAP
  Top 0.813: R19.2 90,42.24
  pour Top (rank 2, no thermals): -0.64,57.64 -0.64,25.57 140.33,25.57 140.33,58.43 113.5,58.43 97.62,42.55 81.43,42.55 74.13,35.25 65.56,35.25 58.25,42.55 42.38,42.55 27.3,57.64
VCC
  Top 0.406: 80.06,60.71 R9.2 R6.1 80.22,62.24 81.43,62.24 | R16.2 61.27,55.1 61.11,55.26
  Top 0.61: C11.+ 78.34,57.16
  Top 0.813: F1.2 81.43,70.36 81.43,62.24 81.43,57.16 | 78.34,57.16 81.43,57.16 | 81.43,57.16 81.43,56.21 79.21,53.98 79.21,48.91
  pour Top (no thermals): 79.53,49.54 79.53,48.59 77.94,47 63.02,47 59.84,43.83 49.36,43.83 49.36,58.75 61.74,58.75 61.74,50.81 63.02,49.54
VDRAIN
  Top 0.305: R15.2 66.77,60.97 | C21.2 66.77,60.97 | R13.2 67.56,61.76 66.77,60.97
  Top 0.406: C21.2 61.11,60.97
  pour Top (no thermals): 49.36,74.62 62.7,74.62 62.7,69.86 61.74,68.91 61.74,59.38 49.36,59.38

### Text on the board
tPlace: High Voltage! | High Voltage! | TIGERs Mannheim | Kicking Device v13b | Design: A.Ryll | High Voltage!